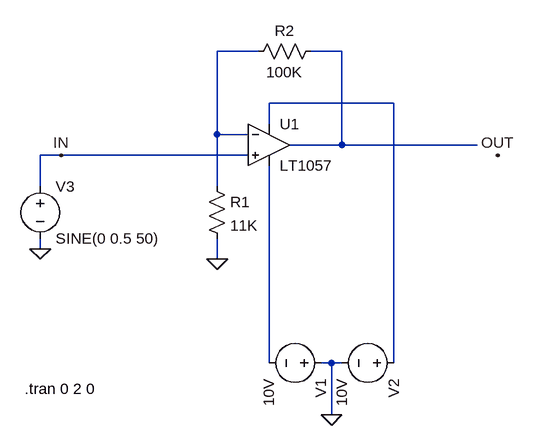
[diagram p0: schematic OpAmpAmplifier.asc]
OpAmpAmplifier.asc, the LTspice schematic file:
Version 4
SHEET 1 880 680
WIRE 144 -128 80 -128
WIRE 272 -128 224 -128
WIRE 352 -48 160 -48
WIRE 160 -16 160 -48
WIRE 80 0 80 -128
WIRE 128 0 80 0
WIRE 272 16 272 -128
WIRE 272 16 192 16
WIRE 480 16 272 16
WIRE -160 32 -192 32
WIRE 128 32 -160 32
WIRE -192 80 -192 32
WIRE 80 80 80 0
WIRE -192 176 -192 160
WIRE 80 192 80 160
WIRE 160 352 160 48
WIRE 256 352 240 352
WIRE 272 352 256 352
WIRE 352 352 352 -48
WIRE 256 432 256 352
FLAG 80 192 0
FLAG 256 432 0
FLAG 512 32 OUT
FLAG -160 32 IN
FLAG -192 176 0
SYMBOL res 64 64 R0
SYMATTR InstName R1
SYMATTR Value 11K
SYMATTR SpiceLine tol=1 pwr=0.1
SYMBOL res 240 -144 R90
WINDOW 0 0 56 VBottom 2
WINDOW 3 32 56 VTop 2
SYMATTR InstName R2
SYMATTR Value 100K
SYMATTR SpiceLine tol=1 pwr=0.1
SYMBOL voltage 256 352 R90
WINDOW 123 0 0 Left 2
WINDOW 39 0 0 Left 2
SYMATTR InstName V1
SYMATTR Value 10V
SYMBOL voltage 368 352 R90
WINDOW 123 0 0 Left 2
WINDOW 39 0 0 Left 2
SYMATTR InstName V2
SYMATTR Value 10V
SYMBOL Opamps\\LT1057 160 -48 R0
SYMATTR InstName U1
SYMBOL voltage -192 64 R0
WINDOW 123 0 0 Left 2
WINDOW 39 0 0 Left 2
SYMATTR InstName V3
SYMATTR Value SINE(0 0.5 50)
TEXT -216 392 Left 2 !.tran 0 2 0

The netlist it stands for:
* OpAmpAmplifier.asc
R1 N001 0 11K tol=1 pwr=0.1
R2 N002 N001 100K tol=1 pwr=0.1
V1 0 N004 10V
V2 N003 0 10V
XU1 IN N001 N003 N004 N002 LT1057  ; pins In+ In- V+ V- OUT
V3 IN 0 SINE(0 0.5 50)
.tran 0 2 0
.lib LTC.lib
.backanno
.end